# EAGLE design ElectronicCompass_T05 (EAGLE 6.5.0)
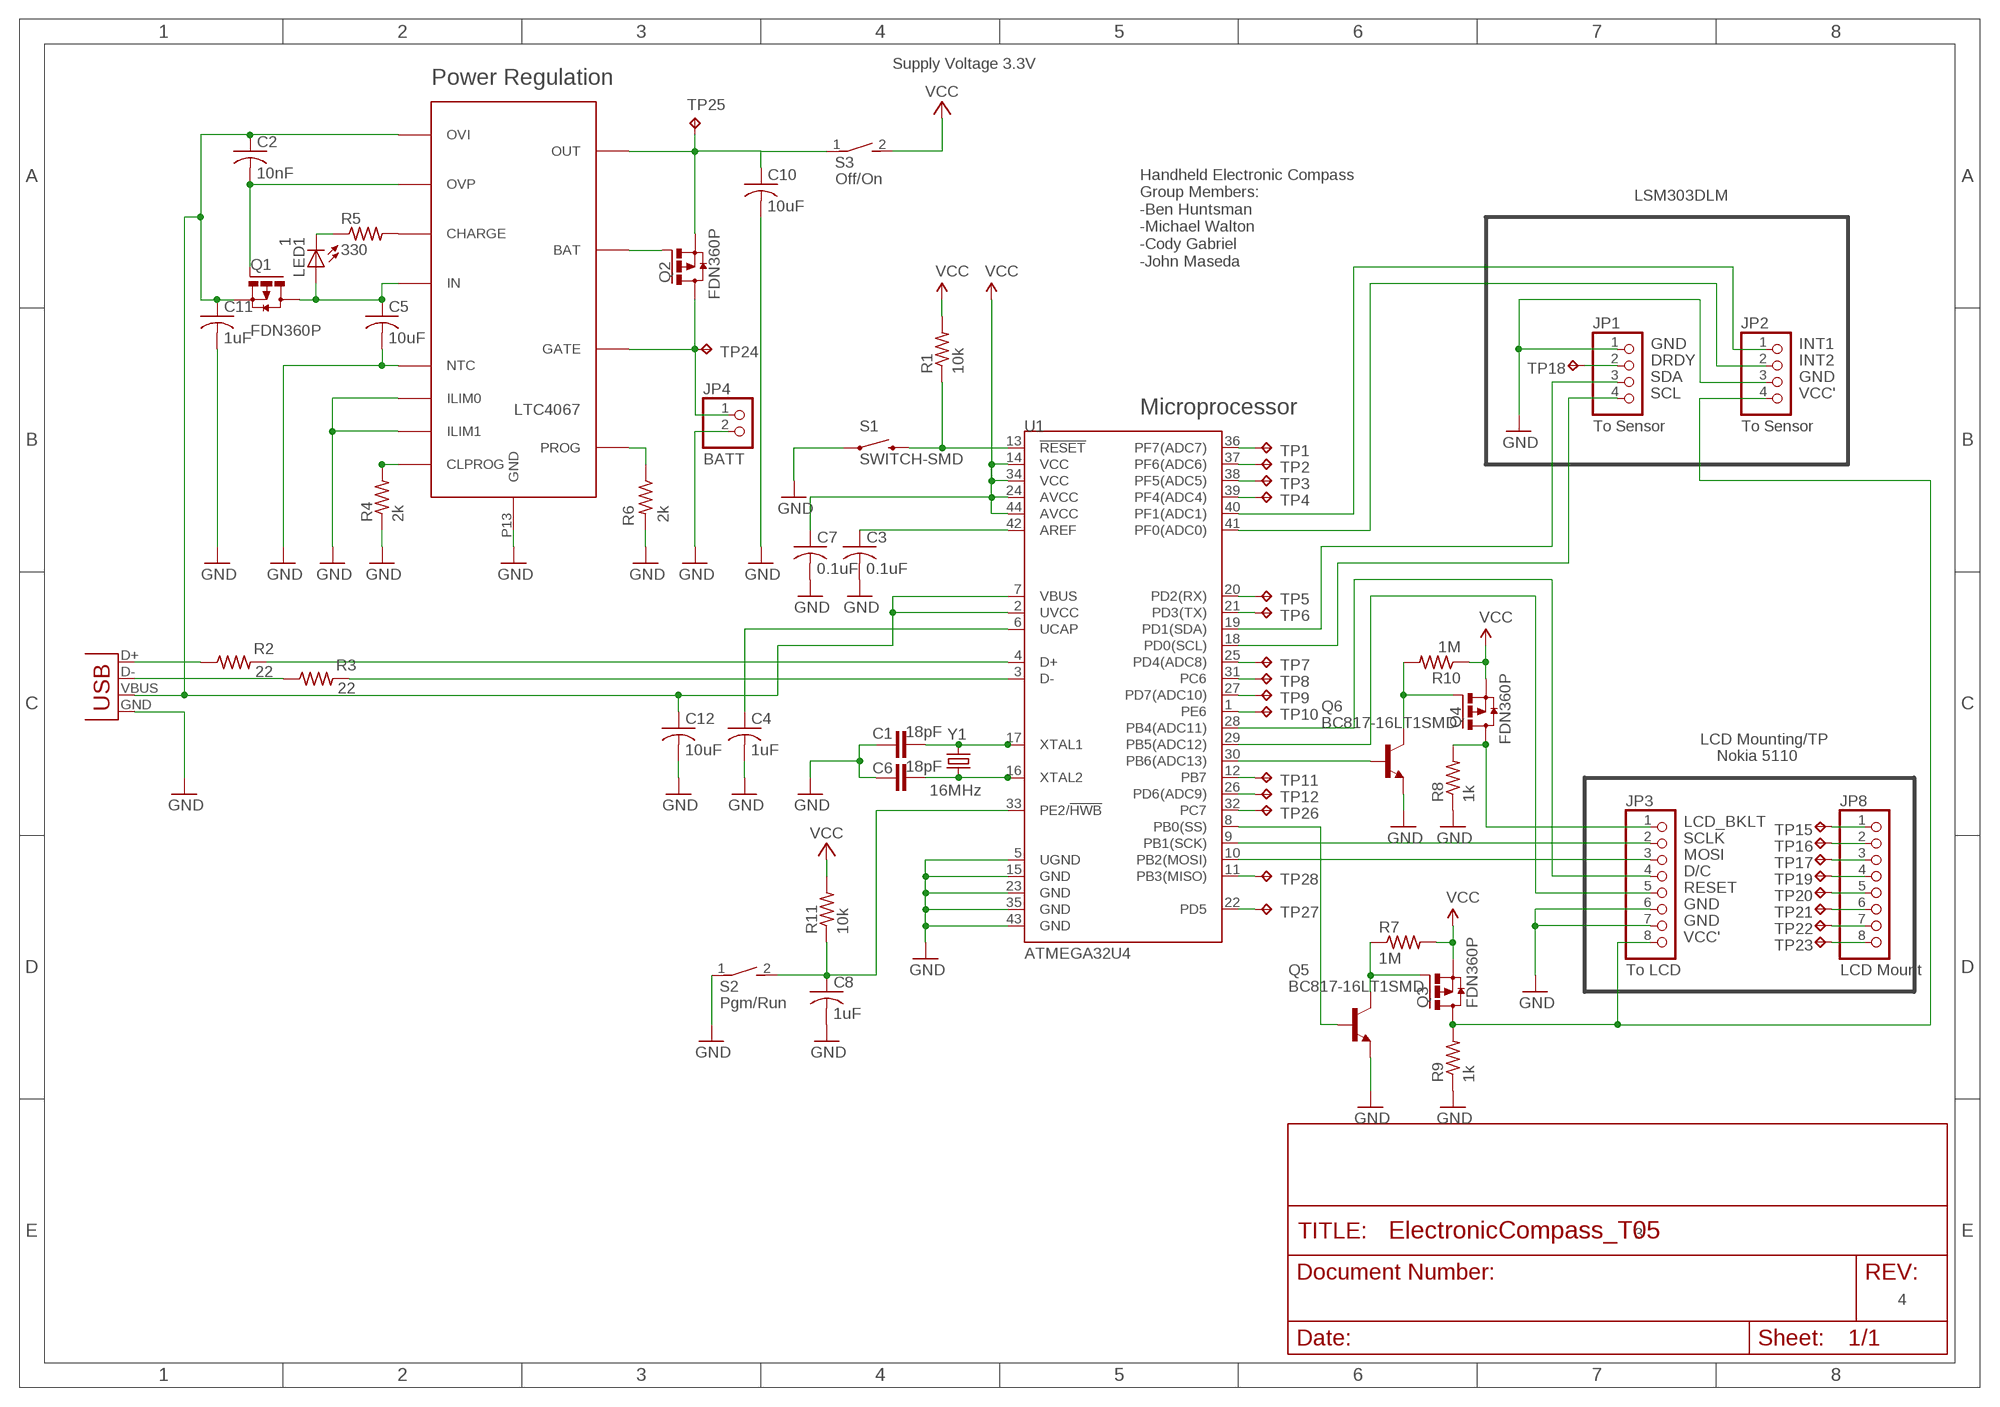
[diagram p0: schematic, sheet 1]

## Parts
C1  18pF  CAP0402-CAP  [0402-CAP]
C2  10nF  C-USC0805  [C0805]
C3  0.1uF  C-USC0805  [C0805]
C4  1uF  C-USC0805  [C0805]
C5  10uF  C-USC0805  [C0805]
C6  18pF  CAP0402-CAP  [0402-CAP]
C7  0.1uF  C-USC0805  [C0805]
C8  1uF  C-USC0805  [C0805]
C10  10uF  C-USC0805  [C0805]
C11  1uF  C-USC0805  [C0805]
C12  10uF  C-USC0805  [C0805]
JP1  To Sensor  PINHD-1X4  [1X04]
JP2  To Sensor  PINHD-1X4  [1X04]
JP3  To LCD  PINHD-1X8  [1X08]
JP4  BATT  PINHD-1X2  [1X02]
JP8  LCD Mount  PINHD-1X8  [1X08]
LED1  1  LEDCHIPLED_0805  [CHIPLED_0805]
Q1  FDN360P  [SUPER-SOT3]
Q2  FDN360P  [SUPER-SOT3]
Q3  FDN360P  [SUPER-SOT3]
Q4  FDN360P  [SUPER-SOT3]
Q5  BC817-16LT1SMD  [SOT23-BEC]
Q6  BC817-16LT1SMD  [SOT23-BEC]
R1  10k  R-US_M0805  [M0805]
R2  22  R-US_M0805  [M0805]
R3  22  R-US_M0805  [M0805]
R4  2k  R-US_M0805  [M0805]
R5  330  R-US_M0805  [M0805]
R6  2k  R-US_M0805  [M0805]
R7  1M  R-US_M0805  [M0805]
R8  1k  R-US_M0805  [M0805]
R9  1k  R-US_M0805  [M0805]
R10  1M  R-US_M0805  [M0805]
R11  10k  R-US_M0805  [M0805]
S1  SWITCH-SMD  SWITCH-MOMENTARY-2SMD  [TACTILE_SWITCH_SMD]
S2  Pgm/Run  DS01E  [DS-01]
S3  Off/On  DS01E  [DS-01]
TP1  TPTP06R  [TP06R]
TP2  TPTP06R  [TP06R]
TP3  TPTP06R  [TP06R]
TP4  TPTP06R  [TP06R]
TP5  TPTP06R  [TP06R]
TP6  TPTP06R  [TP06R]
TP7  TPTP06R  [TP06R]
TP8  TPTP06R  [TP06R]
TP9  TPTP06R  [TP06R]
TP10  TPTP06R  [TP06R]
TP11  TPTP06R  [TP06R]
TP12  TPTP06R  [TP06R]
TP15  TPTP06R  [TP06R]
TP16  TPTP06R  [TP06R]
TP17  TPTP06R  [TP06R]
TP18  TPTP06R  [TP06R]
TP19  TPTP06R  [TP06R]
TP20  TPTP06R  [TP06R]
TP21  TPTP06R  [TP06R]
TP22  TPTP06R  [TP06R]
TP23  TPTP06R  [TP06R]
TP24  TPTP06R  [TP06R]
TP25  TPTP06R  [TP06R]
TP26  TPTP06R  [TP06R]
TP27  TPTP06R  [TP06R]
TP28  TPTP06R  [TP06R]
U1  ATMEGA32U4  ATMEGA32U4QFN2  [QFN-44-NOPAD]
U$1  LTC4067  [DFN-12]
X1  USBSMD  [USB-MINIB]
Y1  16MHz  CRYSTAL5X3  [CRYSTAL-SMD-5X3]

## Nets
D-: R3.2 U1.3(D-)
D/C: JP3.4 U1.28(PB4(ADC11))
DRDY: JP1.2 TP18.TP
GND: C1.1 C3.2 C4.2 C5.2 C6.1 C7.2 C8.2 C10.2 C11.2 C12.2 JP1.1 JP2.3 JP3.6 JP3.7 JP4.2 Q5.E Q6.E R4.1 R6.2 R8.1 R9.1 S1.1 S2.1 U1.5(UGND) U1.15(GND) U1.23(GND) U1.35(GND) U1.43(GND) U$1.P3(NTC) U$1.P4(ILIM0) U$1.P5(ILIM1) U$1.P13(GND) X1.GND
INT1: JP2.1 U1.40(PF1(ADC1))
INT2: JP2.2 U1.41(PF0(ADC0))
LCD_BKLT: JP3.1 Q4.3(D) R8.2
MOSI: JP3.3 U1.10(PB2(MOSI))
N$1: R6.1 U$1.P8(PROG)
N$2: TP26.TP U1.32(PC7)
N$3: TP12.TP U1.26(PD6(ADC9))
N$4: R4.2 U$1.P1(CLPROG)
N$5: JP4.1 Q2.3(D) TP24.TP U$1.P9(GATE)
N$6: C5.1 LED1.A Q1.3(D) U$1.P12(IN)
N$7: R5.2 U$1.P2(CHARGE)
N$8: LED1.C R5.1
N$9: C2.2 Q1.1(G) U$1.P7(OVP)
N$10: JP8.8 TP23.TP
N$11: C8.1 R11.1 S2.2 U1.33(PE2/!HWB)
N$12: R3.1 X1.D-
N$13: R2.1 X1.D+
N$14: TP1.TP U1.36(PF7(ADC7))
N$15: TP2.TP U1.37(PF6(ADC6))
N$16: Q2.1(G) U$1.P10(BAT)
N$17: TP3.TP U1.38(PF5(ADC5))
N$18: TP4.TP U1.39(PF4(ADC4))
N$19: TP5.TP U1.20(PD2(RX))
N$20: TP6.TP U1.21(PD3(TX))
N$21: TP7.TP U1.25(PD4(ADC8))
N$22: TP8.TP U1.31(PC6)
N$23: TP9.TP U1.27(PD7(ADC10))
N$24: TP10.TP U1.1(PE6)
N$25: TP11.TP U1.12(PB7)
N$26: Q4.1(G) Q6.C R10.2
N$28: JP8.7 TP22.TP
N$29: JP8.6 TP21.TP
N$30: JP8.5 TP20.TP
N$31: JP8.4 TP19.TP
N$32: JP8.3 TP17.TP
N$33: JP8.2 TP16.TP
N$34: R2.2 U1.4(D+)
N$35: JP8.1 TP15.TP
N$36: C10.1 Q2.2(S) S3.1 TP25.TP U$1.P11(OUT)
N$37: Q5.B U1.8(PB0(SS))
N$38: C3.1 U1.42(AREF)
N$39: TP27.TP U1.22(PD5)
N$40: TP28.TP U1.11(PB3(MISO))
N$41: C1.2 U1.17(XTAL1) Y1.3
N$42: C6.2 U1.16(XTAL2) Y1.1
N$44: Q6.B U1.30(PB6(ADC13))
N$45: Q3.1(G) Q5.C R7.1
RESET: JP3.5 U1.29(PB5(ADC12))
RST: R1.1 S1.3 U1.13(!RESET)
SCL: JP1.4 U1.18(PD0(SCL))
SCLK: JP3.2 U1.9(PB1(SCK))
SDA: JP1.3 U1.19(PD1(SDA))
UCAP: C4.1 U1.6(UCAP)
VBUS: C2.1 C11.1 C12.1 Q1.2(S) U1.2(UVCC) U1.7(VBUS) U$1.P6(OVI) X1.VBUS
VCC: C7.1 Q3.2(S) Q4.2(S) R1.2 R7.2 R10.1 R11.2 S3.2 U1.14(VCC) U1.24(AVCC) U1.34(VCC) U1.44(AVCC)
VCC': JP2.4 JP3.8 Q3.3(D) R9.2

## Notes on the sheet
- Supply Voltage 3.3V
- Power Regulation
- LSM303DLM
- Handheld Electronic Compass
  Group Members:
  -Ben Huntsman
  -Michael Walton
  -Cody Gabriel
  -John Maseda
- LTC4067 | Microprocessor
- LCD Mounting/TP
- Nokia 5110
- 3
- 4

## Library data of the parts
C1 C6 = SparkFun:CAP: Capacitor Standard 0603 ceramic capacitor, and 0.1" leaded capacitor.
C2-C5 C7 C8 C10-C12 = rcl:C-US: CAPACITOR, American symbol
JP1 JP2 = pinhead:PINHD-1X4: PIN HEADER
JP3 JP8 = pinhead:PINHD-1X8: PIN HEADER
JP4 = pinhead:PINHD-1X2: PIN HEADER
LED1 = led:LED: LED OSRAM: - CHIPLED LG R971, LG N971, LY N971, LG Q971, LY Q971, LO R971, LY R971 LH N974, LH R974 LS Q976, LO Q976, LY Q976 LO Q996 - Hyper CHIPLED LW Q18S LB Q993, LB Q99A, LB R99A - SideLED LS A670, LO A670, LY A670, LG A670, LP A670 LB A673, LV A673, LT A673, LW A673 LH A674 LY A675 LS A676, LA A676, LO A676, LY A676, LW A676 LS A679, LY A679, LG A679 - Hyper Micro SIDELED® LS Y876, LA Y876, LO Y876, LY Y876 LT Y87S - SmartLED LW L88C, LW L88S LB L89C, LB L89S, LG L890 LS L89K, LO L89K, LY L89K LS L896, LA L896, LO L896, LY L896 - TOPLED LS T670, LO T670, LY T670, LG T670, LP T670 LSG T670, LSP T670, LSY T670, LOP T670, LYG T670 LG T671, LOG T671, LSG T671 LB T673, LV T673, LT T673, LW T673 LH T674 LS T676, LA T676, LO T676, LY T676, LB T676, LH T676, LSB T676, LW T676 LB T67C, LV T67C, LT T67C, LS T67K, LO T67K, LY T67K, LW E67C LS E67B, LA E67B, LO E67B, LY E67B, LB E67C, LV E67C, LT E67C LW T67C LS T679, LY T679, LG T679 LS T770, LO T770, LY T770, LG T770, LP T770 LB T773, LV T773, LT T773, LW T773 LH T774 LS E675, LA E675, LY E675, LS T675 LS T776, LA T776, LO T776, LY T776, LB T776 LHGB T686 LT T68C, LB T68C - Hyper Mini TOPLED® LB M676 - Mini TOPLED Santana® LG M470 LS M47K, LO M47K, LY M47K Source: http://www.osram.convergy.de LUXEON: - LUMILED® LXK2-PW12-R00, LXK2-PW12-S00, LXK2-PW14-U00, LXK2-PW14-V00 LXK2-PM12-R00, LXK2-PM12-S00, LXK2-PM14-U00 LXK2-PE12-Q00, LXK2-PE12-R00, LXK2-PE12-S00, LXK2-PE14-T00, LXK2-PE14-U00 LXK2-PB12-K00, LXK2-PB12-L00, LXK2-PB12-M00, LXK2-PB14-N00, LXK2-PB14-P00, LXK2-PB14-Q00 LXK2-PR12-L00, LXK2-PR12-M00, LXK2-PR14-Q00, LXK2-PR14-R00 LXK2-PD12-Q00, LXK2-PD12-R00, LXK2-PD12-S00 LXK2-PH12-R00, LXK2-PH12-S00 LXK2-PL12-P00, LXK2-PL12-Q00, LXK2-PL12-R00 Source: www.luxeon.com KINGBRIGHT: KA-3528ASYC Source: www.kingbright.com
Q1-Q4 = transistor-power:FDN360P: Single P-Channel, PowerTrench (R) MOSFET Source: http://www.fairchildsemi.com/ds/FD/FDN360P.pdf
Q5 Q6 = transistor-npn:BC817*: NPN Transistor
R1-R7 R9-R11 = resistor:R-US_: RESISTOR, American symbol
R8 = rcl:R-US_: RESISTOR, American symbol
S1 = SparkFun:SWITCH-MOMENTARY-2
S2 S3 = switch-dil:DS01E: DIL/CODE SWITCH; OC_FARNELL: unknown; OC_NEWARK: unknown
TP1-TP12 TP15-TP28 = testpad:TP: Test pad
U1 = SparkFun:ATMEGA32U4
U$1 = LTC4067:LTC4067
X1 = SparkFun:USB: USB Connectors USB-B-PTH is fully proven SKU : PRT-00139 USB-miniB is fully proven SKU : PRT-00587 USB-A-PCB is untested. USB-A-H is throughly reviewed, but untested. Spark Fun Electronics SKU : PRT-00437 USB-B-SMT is throughly reviewed, but untested. Needs silkscreen touching up. USB-A-S has not been used/tested USB-MB-H has not been used/tested
Y1 = SparkFun:CRYSTAL: Crystals Various standard crystals. Proven footprints. Spark Fun Electronics SKU : COM-00534

## Board
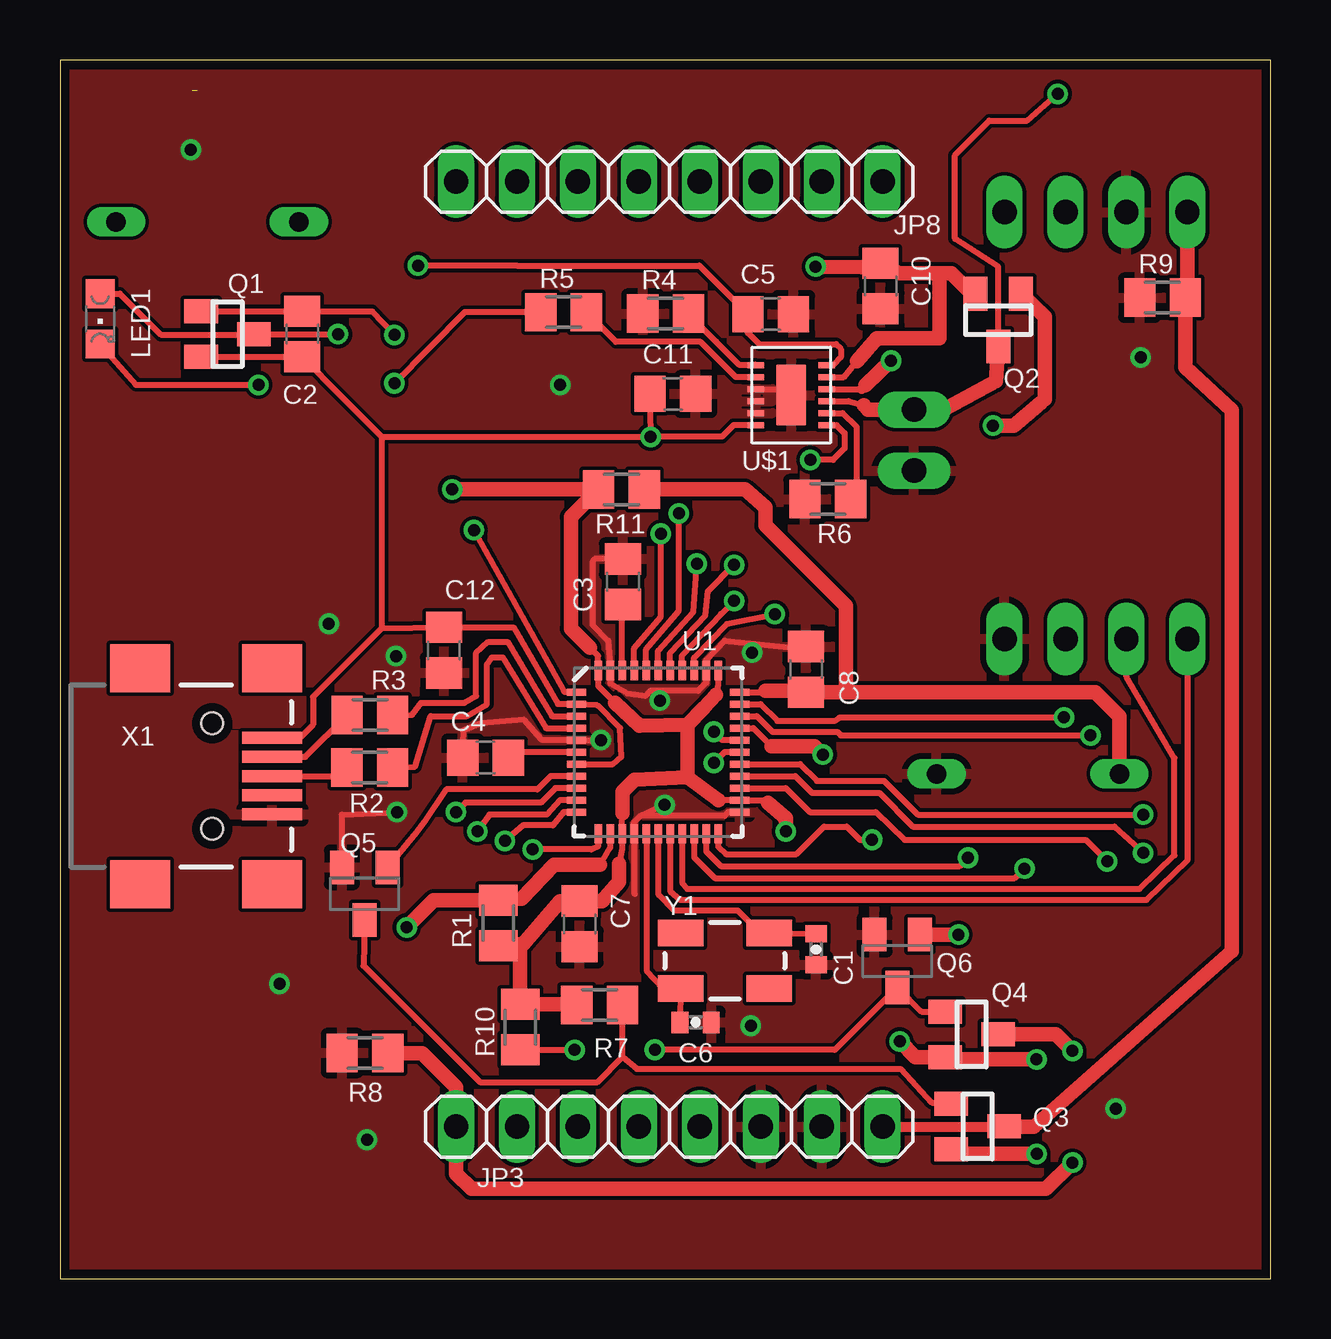
[diagram p1: board, top side]
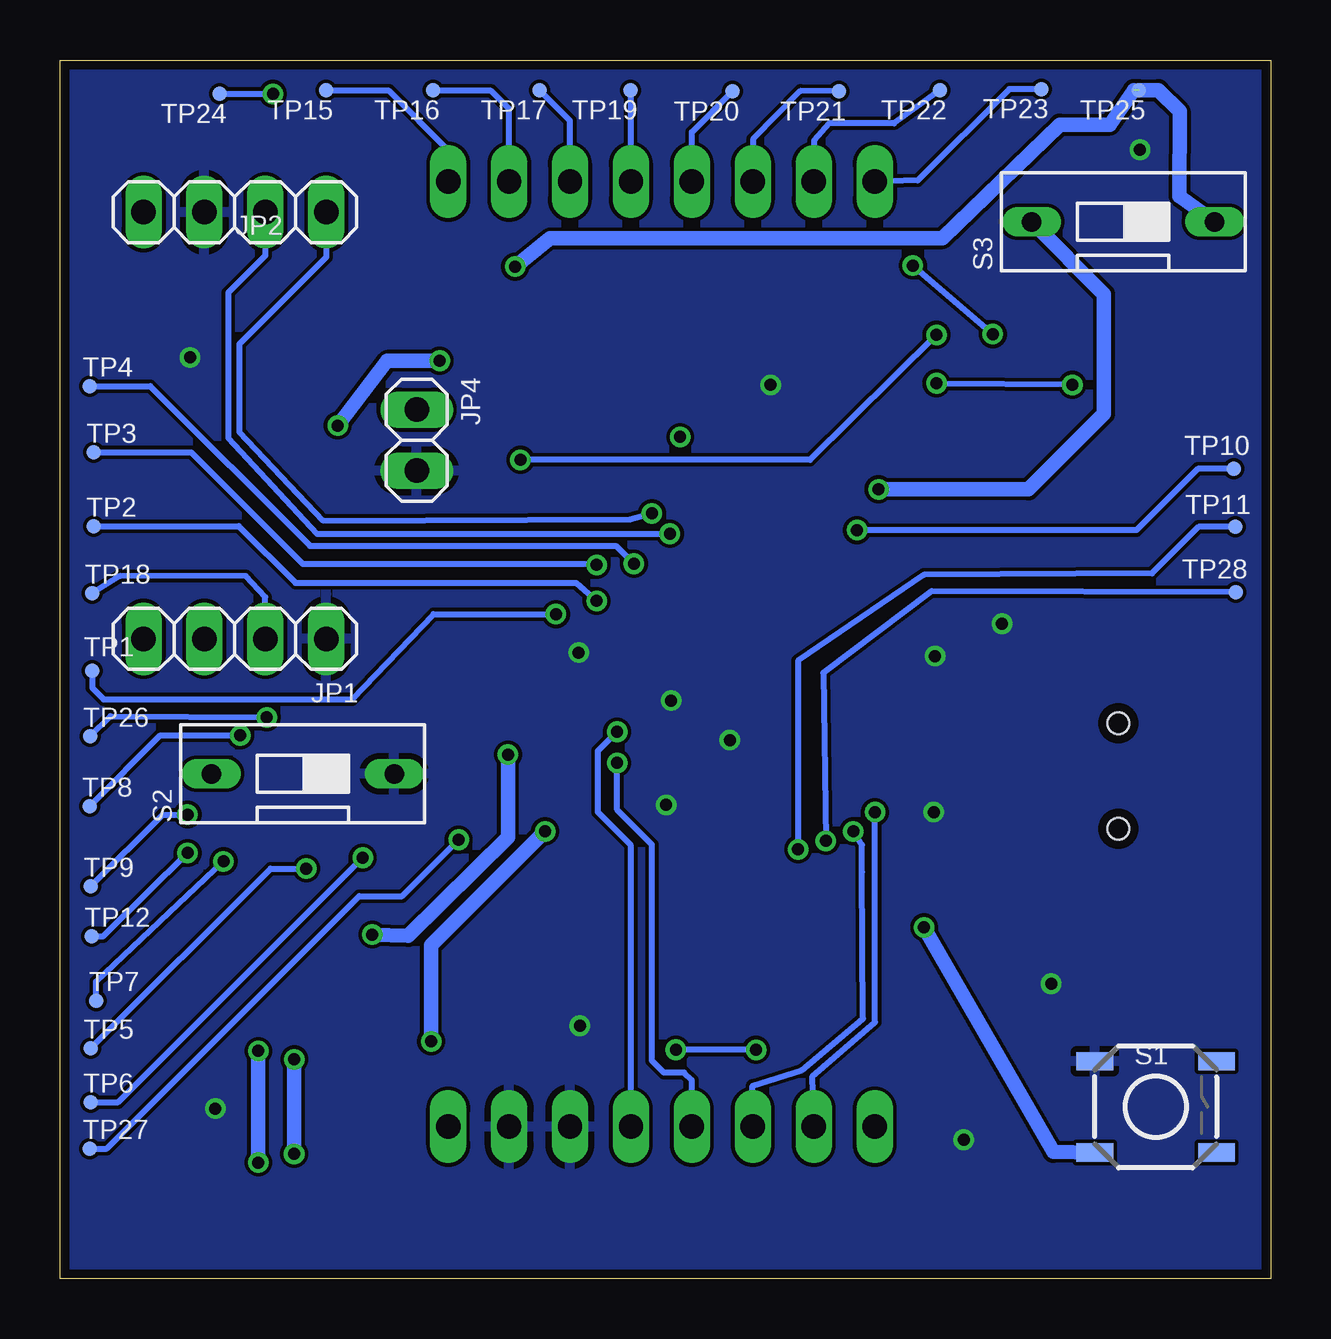
[diagram p2: board, bottom side, seen from below]

Size 50.47 x 50.79 mm. Coordinates in mm from the lower left corner, seen from the top.
Outline: 0,0 50.47,0 50.47,50.79 0,50.79 0,0
Copper layers (1*16): Top 0.0356mm / dielectric 1.5011mm / Bottom 0.0356mm
Design rules "OSHDRU": minimum track width 6mil, minimum drill 13mil, track to track 6mil, track to pad 6mil, pad to pad 6mil, via to via 6mil, smd to smd 6mil, copper to edge 15mil, drill to drill 6mil, minimum pad ring 7mil, minimum via ring 7mil, stop-mask expansion 3mil, vias tented up to drill 0mil, thermal gap 10mil

### Footprints (pad centres in the part's own frame; a part is rotated, then mirrored left to right if it is on the bottom)
0402-CAP = smd 0.7 x 0.9: 1 -0.65,0; 2 0.65,0
C0805 = smd 1.3 x 1.5: 1 -0.95,0; 2 0.95,0
1X04 = drill 1.016 long: 1 -3.81,0; 2 -1.27,0; 3 1.27,0; 4 3.81,0
1X08 = drill 1.016 long: 1 -8.89,0; 2 -6.35,0; 3 -3.81,0; 4 -1.27,0; 5 1.27,0; 6 3.81,0; 7 6.35,0; 8 8.89,0
1X02 = drill 1.016 long: 1 -1.27,0; 2 1.27,0
CHIPLED_0805 = smd 1.2 x 1.2: A 0,-1.05; C 0,1.05
SUPER-SOT3 = smd 1 x 1.4: 1 -0.95,-1.1; 2 0.95,-1.1; 3 0,1.1
SOT23-BEC = smd 1 x 1.4: B -0.95,-1.1; C 0,1.1; E 0.95,-1.1
M0805 = smd 1.3 x 1.6: 1 -0.95,0; 2 0.95,0
TACTILE_SWITCH_SMD = smd 1.524 x 0.762: 1 -2.54,1.905; 2 2.54,1.905; 3 -2.54,-1.905; 4 2.54,-1.905
DS-01 = drill 0.813 long: 1 0,-3.81; 2 0,3.81
TP06R = smd 0.6 x 0.6: TP 0,0
QFN-44-NOPAD = smd 0.8 x 0.3: 1 -3.4,2.5; 2 -3.4,2; 3 -3.4,1.5; 4 -3.4,1; 5 -3.4,0.5; 6 -3.4,0; 7 -3.4,-0.5; 8 -3.4,-1; 9 -3.4,-1.5; 10 -3.4,-2; 11 -3.4,-2.5; 23 3.4,-2.5; 24 3.4,-2; 25 3.4,-1.5; 26 3.4,-1; 27 3.4,-0.5; 28 3.4,0; 29 3.4,0.5; 30 3.4,1; 31 3.4,1.5; 32 3.4,2; 33 3.4,2.5 | smd 0.3 x 0.8: 12 -2.5,-3.4; 13 -2,-3.4; 14 -1.5,-3.4; 15 -1,-3.4; 16 -0.5,-3.4; 17 0,-3.4; 18 0.5,-3.4; 19 1,-3.4; 20 1.5,-3.4; 21 2,-3.4; 22 2.5,-3.4; 34 2.5,3.4; 35 2,3.4; 36 1.5,3.4; 37 1,3.4; 38 0.5,3.4; 39 0,3.4; 40 -0.5,3.4; 41 -1,3.4; 42 -1.5,3.4; 43 -2,3.4; 44 -2.5,3.4
DFN-12 = smd 0.25 x 0.7: P1 -1.25,-1.477; P2 -0.75,-1.477; P3 -0.25,-1.477; P4 0.25,-1.477; P5 0.75,-1.477; P6 1.25,-1.477; P7 1.25,1.477; P8 0.75,1.477; P9 0.25,1.477; P10 -0.25,1.477; P11 -0.75,1.477; P12 -1.25,1.477 | smd 2.54 x 1.27: P13 0,0
USB-MINIB = smd 2.5 x 0.5: D+ 2.5,0; D- 2.5,0.8; GND 2.5,-1.6; ID 2.5,-0.8; VBUS 2.5,1.6 | smd 2.5 x 2: MTN1 -3,4.5; MTN2 2.5,4.5; MTN3 -3,-4.5; MTN4 2.5,-4.5 | hole 0.9: 0,2.2; 0,-2.2
CRYSTAL-SMD-5X3 = smd 1.9 x 1.1: 1 -1.85,-1.15; 2 1.85,-1.15; 3 1.85,1.15; 4 -1.85,1.15

### Placement (x,y rotation side)
C1  31.52,13.74 90 top
C2  10.1,39.37 90 top
C3  23.47,29.05 90 top
C4  17.74,21.72 180 top
C5  29.62,40.2 0 top
C6  26.5,10.69 180 top
C7  21.67,14.79 270 top
C8  31.1,25.4 90 top
C10  34.2,41.38 270 top
C11  25.55,36.88 0 top
C12  16,26.2 270 top
JP1  43.18,26.67 180 bottom
JP2  43.18,44.45 180 bottom
JP3  25.4,6.35 0 top
JP4  35.6,34.95 270 bottom
JP8  25.4,45.72 180 top
LED1  1.68,40.01 180 top
Q1  6.99,39.37 270 top
Q2  39.11,39.95 180 top
Q3  38.25,6.36 270 top
Q4  38,10.19 270 top
Q5  12.7,16.05 180 top
Q6  34.9,13.25 180 top
R1  18.26,14.83 270 top
R2  12.91,21.32 0 top
R3  12.92,23.5 0 top
R4  25.25,40.23 0 top
R5  20.99,40.28 0 top
R6  32.01,32.49 180 top
R7  22.5,11.41 180 top
R8  12.71,9.42 0 top
R9  45.95,40.89 0 top
R10  19.18,10.49 270 top
R11  23.4,32.9 180 top
S1  4.79,7.17 0 bottom
S2  40.35,21.05 90 bottom
S3  6.15,44.05 90 bottom
TP1  49.12,25.35 0 bottom
TP2  49.07,31.36 0 bottom
TP3  49.06,34.44 0 bottom
TP4  49.23,37.2 0 bottom
TP5  49.18,9.61 0 bottom
TP6  49.2,7.37 0 bottom
TP7  48.96,11.6 0 bottom
TP8  49.24,19.7 0 bottom
TP9  49.18,16.36 0 bottom
TP10  1.54,33.75 0 bottom
TP11  1.47,31.34 180 bottom
TP12  49.15,14.28 0 bottom
TP15  39.37,49.53 180 bottom
TP16  34.92,49.53 180 bottom
TP17  30.48,49.53 180 bottom
TP18  49.13,28.57 0 bottom
TP19  26.68,49.53 180 bottom
TP20  22.44,49.48 180 bottom
TP21  18,49.48 180 bottom
TP22  13.8,49.53 180 bottom
TP23  9.55,49.58 180 bottom
TP24  43.81,49.38 180 bottom
TP25  5.51,49.53 180 bottom
TP26  49.2,22.61 0 bottom
TP27  49.22,5.43 0 bottom
TP28  1.45,28.61 90 bottom
U1  24.93,21.95 0 top
U$1  30.48,36.83 270 top
X1  6.35,20.95 0 top
Y1  27.72,13.26 0 top

### Tracks (layer width: path | path; a pad name or v marks a point on that pad's centre or on a via)
D-
  Top 0.254: R3.2 14.67,23.5 15.05,24 16.85,24 17.35,24.3 17.35,26.1 17.85,26.55 18.65,26.55 19.85,24.55 20.5,23.45 U1.3
D/C  (via drill 0.5)
  Top 0.254: U1.28 27.7,21.95 v27.25,21.5
  Bottom 0.254: JP3.4 24.13,8.28 24.45,8.6 25.3,8.6 25.8,9.1 25.8,18.1 27.25,19.55 v27.25,21.5
DRDY
  Bottom 0.254: JP1.2 41.91,28.41 42.73,29.28 47.95,29.3 TP18.TP
GND  (via drill 0.5)
  Top 0.254: U$1.P3 30.23,37.08 U$1.P13 | 23.95,16.05 23.93,16.07 U1.15 23.93,19.04 24.2,19.3 | C8.2 31,26.25 27.7,26.6 26.93,25.79 U1.35 26.93,24.84 26.6,24.5 24.6,24.5 24.4,24.3 23.65,24.4 22.93,24.82 U1.43 22.95,25.38 22.85,26.6 22.2,27.25 22.2,29.9 22.3,30 C3.2 | U1.23 27.85,19.45 27.7,19.3 24.2,19.3 | 22.45,22.45 U1.5 20.1,22.45 19.35,23.3 17.55,23.15 16.8,22.85 16.75,21.75 | Q5.E 11.75,19.35 v14.05,19.45 | 24.2,19.3 v25.2,19.75
  other vias: 14,25.95 22.55,22.45 25,24.1 28.8,10.55 12.8,5.8 11.2,27.3 28.85,26.1 20.85,37.25 5.45,47.05 44,7.1 45.05,38.4 9.15,12.3
  pour Bottom: 0,50.8 50.32,50.64 50.32,-0.16 0,0
  pour Top: 0.1,50.95 50.32,50.64 50.32,-0.16 0.1,0.15
INT1  (via drill 0.5)
  Top 0.254: U1.40 24.43,26.23 25.8,27.85 v25.8,31.9
  Bottom 0.254: JP2.1 39.37,42.58 43,38.95 43,35.3 39.5,31.6 26.7,31.65 v25.8,31.9
INT2  (via drill 0.5)
  Top 0.254: U1.41 23.93,26.29 25.05,27.6 v25.05,31.05
  Bottom 0.254: JP2.2 41.91,42.64 43.45,41.1 43.45,35.05 39.75,31.05 v25.05,31.05
LCD_BKLT  (via drill 0.5)
  Top 0.254: Q4.3
  Top 0.61: R8.2 13.68,9.4 15.1,9.4 16.51,7.99 JP3.1 16.51,4.39 17.15,3.75 41.1,3.75 v42.2,4.85 | v42.2,9.5 41.5,10.2 Q4.3
  Bottom 0.61: v42.2,4.85 v42.2,9.5
MOSI  (via drill 0.5)
  Top 0.254: U1.10 20.85,19.95 20.3,19.35 17.9,19.35 v17.4,18.65
  Bottom 0.254: JP3.3 21.6,8.05 19.55,8.7 17,10.85 17.04,16.96 17.04,18.09 v17.4,18.65
N$1
  Top 0.254: U$1.P8 32.62,36.08 33.2,35.5 33.2,32.74 R6.1
N$2  (via drill 0.5)
  Top 0.254: U1.32 29.2,23.95 29.9,23.25 32.3,23.25 32.5,23.4 v41.85,23.4
  Bottom 0.254: TP26.TP 48.36,23.45 v41.85,23.4
N$3  (via drill 0.5)
  Top 0.254: U1.26 30.65,20.95 31.35,20.25 34.15,20.25 35.55,18.85 43.95,18.85 v45.15,17.75
  Bottom 0.254: TP12.TP 48.67,14.28 v45.15,17.75
N$4
  Top 0.254: R4.2 27.34,39.05 28.3,38.1 28.98,38.1 U$1.P1
N$5  (via drill 0.5)
  Top 0.254: Q2.3 39.11,42.17 37.31,43.34 37.31,46.83 38.73,48.26 40.32,48.26 v41.59,49.38 | U$1.P9 32.87,36.58 33.5,36.4
  Top 0.61: Q2.3 39,37.4 36.82,36.22 JP4.1 33.68,36.22 33.5,36.4
  Bottom 0.254: TP24.TP v41.59,49.38
N$6  (via drill 0.5)
  Top 0.254: v14.92,42.23 19.05,42.23 26.66,42.23 C5.1 28.68,39.42 29.15,38.95 32.35,38.95 32.55,38.75 32.55,38.4 32.23,38.08 U$1.P12 | v11.59,39.37 Q1.3 8.06,39.35 4.2,39.35 2.5,41.05 LED1.A
  Bottom 0.254: v11.59,39.37 v14.92,42.23
N$7
  Top 0.254: U$1.P2 28.17,37.58 26.7,39.05 23.17,39.05 R5.2
N$8  (via drill 0.5)
  Top 0.254: R5.1 16.87,40.28 v13.94,37.32 | LED1.C 3.17,37.26 v8.27,37.26
  Bottom 0.254: v8.27,37.26 13.92,37.3 v13.94,37.32
N$9  (via drill 0.5)
  Top 0.254: v13.94,39.34 13.02,40.32 C2.2 Q1.1 | U$1.P7 32.37,35.58 32.7,35.24 32.7,34.61 32.23,34.13 v31.27,34.13
  Bottom 0.254: v13.94,39.34 19.21,34.13 v31.27,34.13
N$10
  Bottom 0.254: TP23.TP 10.91,49.58 14.72,45.77 JP8.8
N$11
  Top 0.254: U1.33 29.3,24.45 29.4,24.5 | 32.75,24.65 32.95,24.45
  Top 0.61: S2.2 44.16,23.44 43.15,24.45 32.95,24.45 C8.1 31.05,24.5 29.4,24.5 | R11.1 28.55,32.9 29.4,32.15 29.4,31.4 32.75,28.05 32.75,24.65
N$12
  Top 0.254: X1.D- 10.23,21.75 R3.1
N$13
  Top 0.254: X1.D+ 11.6,20.95 R2.1
N$14  (via drill 0.5)
  Top 0.254: U1.36 26.43,25.89 27.8,27.3 v29.8,27.7
  Bottom 0.254: TP1.TP 49.12,24.62 48.65,24.15 38.3,24.15 34.9,27.7 v29.8,27.7
N$15  (via drill 0.5)
  Top 0.254: U1.37 25.93,25.98 27.55,27.7 v28.1,28.25
  Bottom 0.254: TP2.TP 43.02,31.36 40.65,29 28.95,29 v28.1,28.25
N$16  (via drill 0.5)
  Top 0.254: 41.03,36.63 40.89,36.51 41.05,36.66 | U$1.P10 33.42,37.08
  Top 0.406: 33.42,37.08 33.57,37.23
  Top 0.61: Q2.1 41.05,40.1 41.05,36.66 | 40.89,36.51 39.76,35.56 v38.89,35.56 | 33.57,37.23 v34.64,38.26
  Bottom 0.61: v34.64,38.26 36.83,38.26 v38.89,35.56
N$17  (via drill 0.5)
  Top 0.254: U1.38 25.43,26.09 26.9,27.65 27,28.65 v28.1,29.75
  Bottom 0.254: TP3.TP 44.99,34.44 40.35,29.8 28.15,29.8 v28.1,29.75
N$18  (via drill 0.5)
  Top 0.254: U1.39 24.93,26.18 26.4,27.8 v26.55,29.8
  Bottom 0.254: TP4.TP 46.7,37.2 40.05,30.55 27.3,30.55 v26.55,29.8
N$19  (via drill 0.5)
  Top 0.254: U1.20 26.43,17.57 27.3,16.7 39.8,16.7 v40.2,17.1
  Bottom 0.254: TP5.TP 41.69,17.1 v40.2,17.1
N$20  (via drill 0.5)
  Top 0.254: U1.21 26.93,17.82 27.55,17.2 37.5,17.2 v37.85,17.55
  Bottom 0.254: TP6.TP 48.03,7.37 v37.85,17.55
N$21  (via drill 0.5)
  Top 0.254: U1.25 30.25,20.45 31.25,19.45 34,19.45 35.2,18.3 42.75,18.3 v43.65,17.4
  Bottom 0.254: TP7.TP 48.96,12.39 v43.65,17.4
N$22  (via drill 0.5)
  Top 0.254: U1.31 29.05,23.45 29.7,22.8 32.4,22.8 32.55,22.65 v42.95,22.65
  Bottom 0.254: TP8.TP 46.29,22.65 v42.95,22.65
N$23  (via drill 0.5)
  Top 0.254: U1.27 30.85,21.45 31.55,20.75 34.35,20.75 35.75,19.35 v45.15,19.35
  Bottom 0.254: TP9.TP 46.19,19.35 v45.15,19.35
N$24  (via drill 0.5)
  Top 0.254: U1.1 21.05,24.45 21,24.5 v17.25,31.2
  Bottom 0.254: TP10.TP 3.05,33.75 5.6,31.2 v17.25,31.2
N$25  (via drill 0.5)
  Top 0.254: U1.12 22.43,18.04 22.15,17.9 v19.7,17.9
  Bottom 0.254: TP11.TP 3.01,31.34 4.95,29.4 14.46,29.34 19.7,25.75 v19.7,17.9
N$26  (via drill 0.5)
  Top 0.254: R10.2 v21.45,9.54 | Q4.1 35.91,11.14 Q6.C 32.3,9.55 v24.8,9.55
  Bottom 0.254: v21.45,9.54 v21.46,9.55 v24.8,9.55
N$28
  Bottom 0.254: TP22.TP 15.7,48.15 18.4,48.15 19.04,47.43 JP8.7
N$29
  Bottom 0.254: TP21.TP 19.6,49.5 21.58,47.48 JP8.6
N$30
  Bottom 0.254: JP8.5 24.13,47.79 TP20.TP
N$31
  Bottom 0.254: TP19.TP 26.68,47.66 JP8.4
N$32
  Bottom 0.254: JP8.3 29.21,48.26 TP17.TP
N$33
  Bottom 0.254: JP8.2 31.75,48.75 32.5,49.5 34.9,49.5 TP16.TP
N$34
  Top 0.254: R2.2 14.8,21.35 15.45,23.45 16.95,23.45 17.8,23.95 17.8,25.6 18,25.9 18.45,25.9 20.25,22.95 U1.4
N$35
  Bottom 0.254: JP8.1 34.29,47.04 36.75,49.5 39.34,49.5 TP15.TP
N$36  (via drill 0.5)  (1 unrouted)
  Top 0.254: Q2.2 38.01,41.05 | U$1.P11 32.67,37.58 33.22,38.23
  Top 0.61: v31.5,42.18 33.42,42.16 C10.1 34.98,41.91 36.65,41.91 | 38.01,41.05 37.15,41.91 36.65,41.91 | 33.22,38.23 34.05,39.2 36.65,39.2 36.65,41.91
  Bottom 0.61: v31.5,42.18 30.04,43.36 13.69,43.37 8.8,48.1 6.7,48.09 5.71,49.53 | TP25.TP 4.68,49.53 3.8,48.65 3.81,45.12 S3.1
N$37
  Top 0.254: U1.8 20.45,20.95 19.9,20.4 16.1,20.4 15.15,19 14.85,18.6 Q5.B
N$38
  Top 0.254: U1.42 23.43,28.07 C3.1
N$39  (via drill 0.5)
  Top 0.254: U1.22 27.43,18.02 27.75,17.7 30.7,17.7 31.85,18.85 32.8,18.85 33.35,18.3 v33.85,18.3
  Bottom 0.254: TP27.TP 48.52,5.43 38,15.95 36.2,15.95 v33.85,18.3
N$40  (via drill 0.5)
  Top 0.254: U1.11 21,19.45 20.55,18.9 19.3,18.9 v18.55,18.25
  Bottom 0.254: TP28.TP 14.14,28.66 18.65,25.25 v18.55,18.25
N$41
  Top 0.254: C1.2 Y1.3 29.19,14.41 28.25,15.35 25.6,15.35 24.95,16 24.95,18.53 U1.17
N$42
  Top 0.254: C6.2 Y1.1 25.14,12.11 24.45,12.85 24.45,18.53 U1.16
N$44  (via drill 0.5)
  Top 0.254: U1.30 28.9,22.95 29.65,22.2
  Top 0.61: Q6.B v37.45,14.35 | 29.65,22.2 31.45,22.2 v31.8,21.85
  Bottom 0.61: v37.45,14.35 35.95,14.3 31.8,18.4 v31.8,21.85
N$45
  Top 0.254: Q5.C 12.65,13.05 17.5,8.2 22.4,8.2 23.45,9.25 | 23.45,9.25 R7.1 | 23.45,9.25 24.05,8.75 35.05,8.75 36.35,7.35 37.11,7.35 Q3.1
RESET  (via drill 0.5)
  Top 0.254: U1.29 27.6,22.45 v27.25,22.8
  Bottom 0.254: JP3.5 26.67,18.07 28.05,19.45 28.05,22 v27.25,22.8
RST  (via drill 0.5)
  Top 0.254: U1.13 22.93,17.98 22.5,17.25
  Top 0.61: 22.5,17.25 20.6,17.25 19.23,15.83 R1.1 15.58,15.78 v14.45,14.65
  Bottom 0.61: S1.3 9.07,5.3 v14.45,14.65
SCL
  Top 0.254: U1.18 25.43,16.16 25.85,15.8 45.3,15.8 47,17.45 47,25.26 JP1.4
SCLK  (via drill 0.5)
  Top 0.254: U1.9 20.65,20.45 20.05,19.85 16.9,19.85 v16.5,19.45
  Bottom 0.254: JP3.2 19.1,8.45 16.5,10.7 v16.5,19.45
SDA
  Top 0.254: U1.19 25.93,16.52 26.15,16.25 45,16.25 46.45,17.65 46.45,21.7 44.45,25.1 JP1.3
UCAP
  Top 0.254: U1.6 18.77,21.95 C4.1
VBUS  (via drill 0.5)
  Top 0.254: 13.42,27.12 10.55,24.25 10.55,23.1 10.01,22.55 X1.VBUS | C11.1 24.6,36.2 v24.62,35.08 | 13.42,35.08 11.75,36.75 C2.1 Q1.2 | 13.42,35.08 v24.62,35.08 | U$1.P6 28.08,35.58 27.6,35.1 24.63,35.1 v24.62,35.08 | 13.42,35.08 13.42,27.12 | U1.7 23.05,21.45 23.4,21.75 23.35,22.95 22.4,23.9 U1.2 20.75,23.95 18.9,27.15 C12.1 13.42,27.12
VCC  (via drill 0.5)
  Top 0.254: 23.3,17.3 23.43,17.93 U1.14 23.43,18.84 23.45,19.4 | 27.45,19.95 27.75,19.95 U1.24 29.4,19.95 29.5,19.85 | U1.34 27.43,24.77 27.35,24.35 | 23.14,24.02 22.43,24.71 U1.44 22.43,25.96 22.1,26.3 | 36.99,9.15 Q4.2
  Top 0.61: 23.3,17.3 23.3,16.55 22.59,15.74 C7.1 20.84,15.74 19.3,13.95 | 23.45,19.4 23.45,20.3 23.95,20.8 26.15,20.9 | 26.15,20.9 27.45,19.95 | 27.35,24.35 26.85,23.8 26.15,23.1 | 26.15,23.1 26.15,20.9 | 23.14,24.02 24.15,23.05 26.15,23.1 | R1.2 18.34,13.96 19.3,13.95 | 21.64,11.5 R7.2 21.51,11.45 R10.1 19.18,13.83 19.3,13.95 | v40.7,9.15 36.99,9.15 | v16.35,32.9 R11.2 21.3,31.75 21.3,27.1 22.1,26.3 | Q3.2 37.35,5.21 v40.71,5.21 | Q4.2 35.66,9.24 v35,9.9 | v30.25,18.65 30.25,19.2 29.5,19.85
  Bottom 0.254: v40.71,9.14 v40.7,9.15
  Bottom 0.61: S3.2 6.95,41.04 6.95,36.05 10.1,32.9 v16.35,32.9 | v40.71,5.21 v40.71,9.14 | v35,9.9 35,13.9 v30.25,18.65
VCC'
  Top 0.254: 39.31,6.35 Q3.3 | 46.99,41.07 R9.2
  Top 0.406: JP3.8 39.31,6.35
  Top 0.61: 39.31,6.35 40.6,6.35 48.85,13.65 48.85,36.2 46.91,37.99 R9.2 | JP2.4 46.99,41.07